# EAGLE design blmc_m8_dev (EAGLE 4.11)
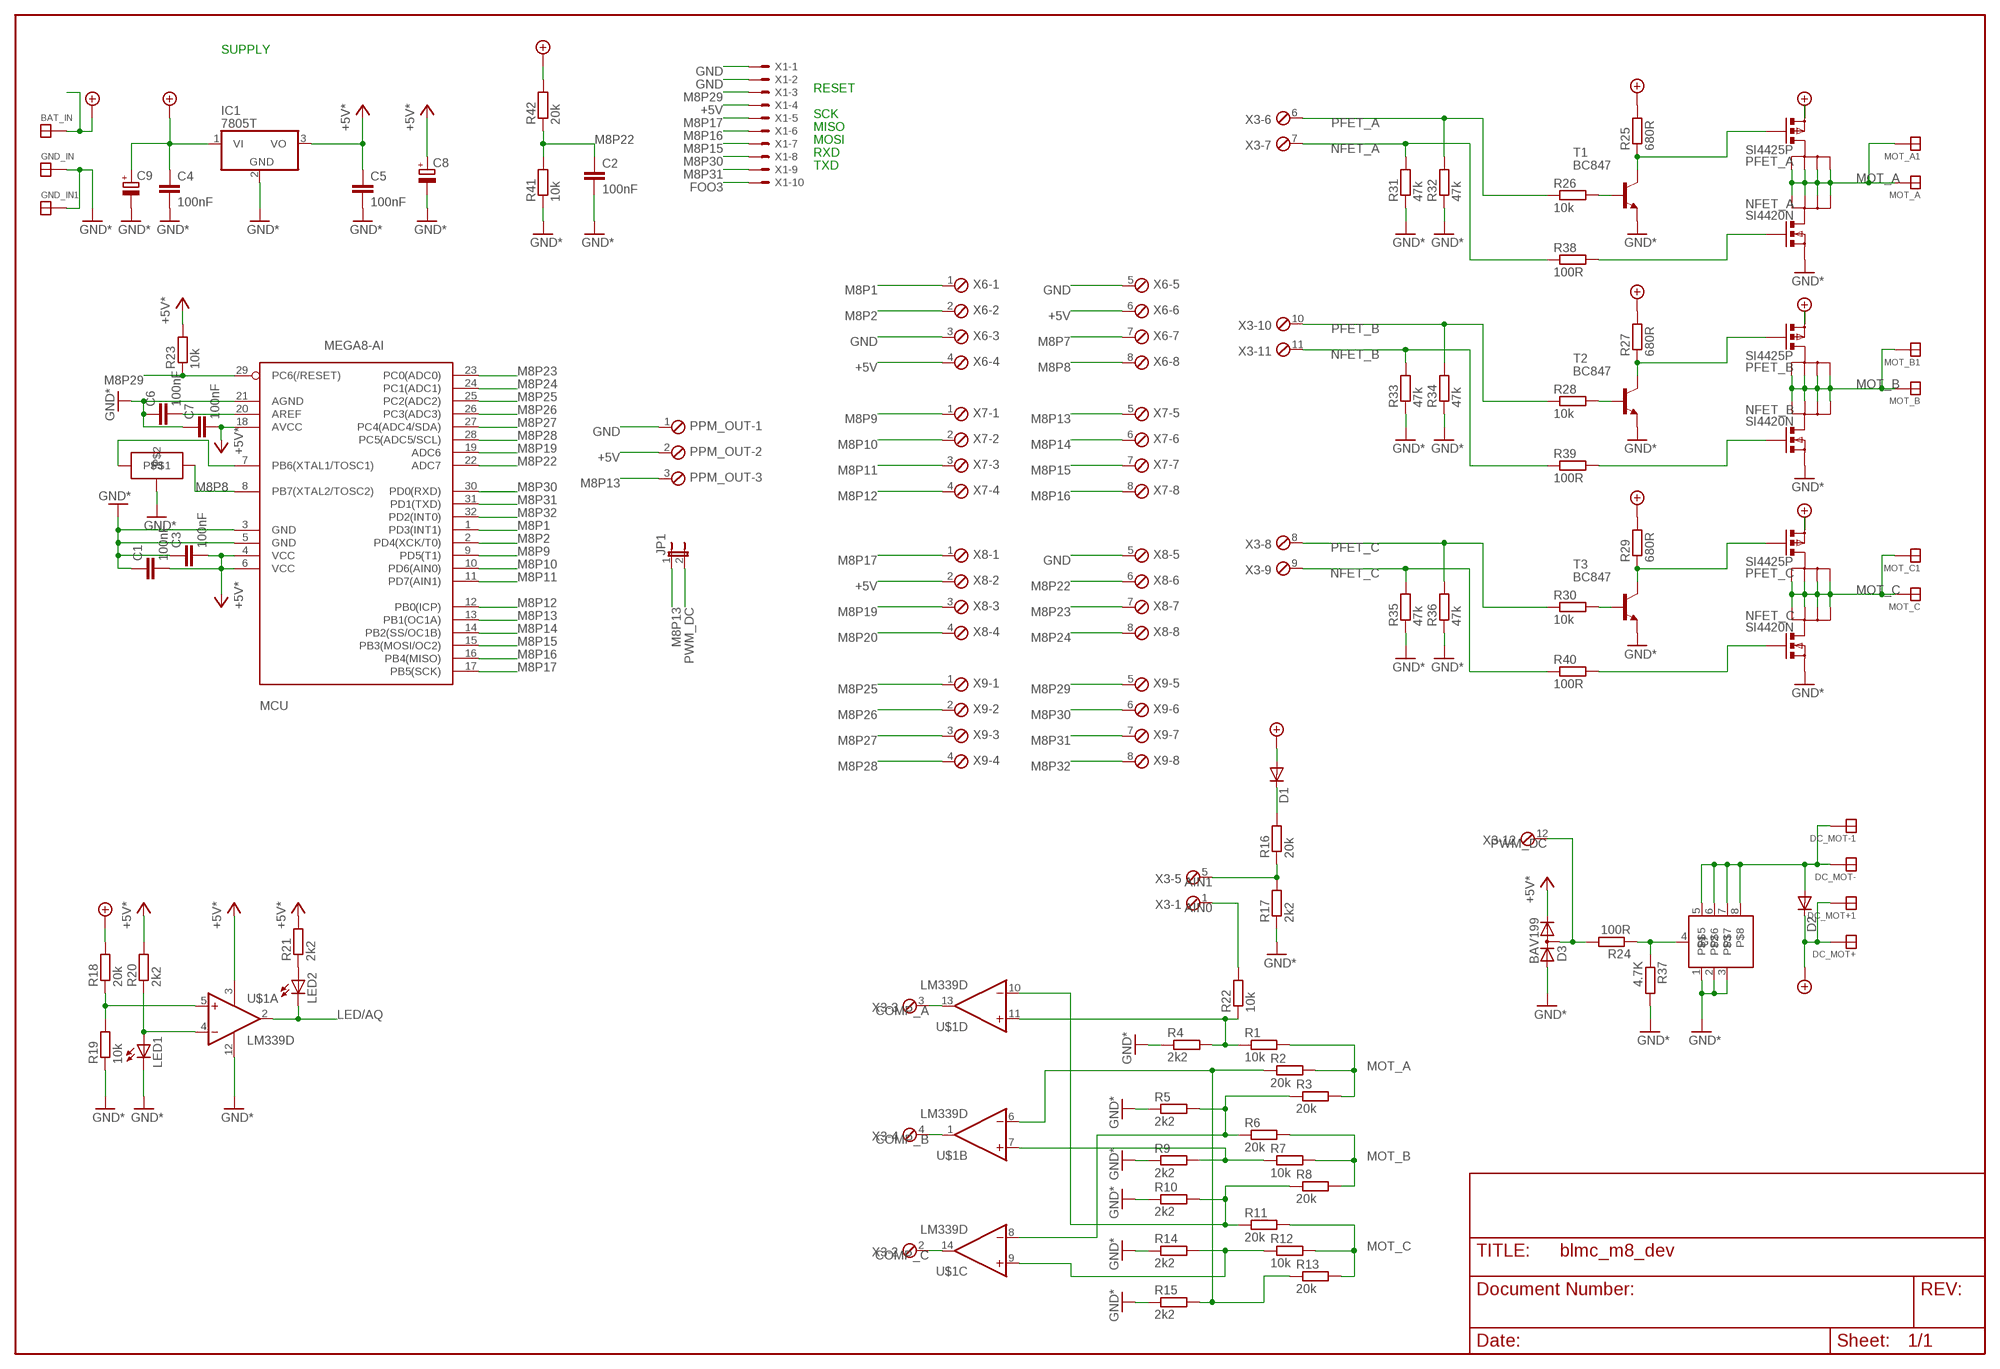
[diagram p0: schematic, sheet 1]

## Parts
BAT_IN  SOLDER_PAD200_50  [SOLDER_PAD_200_50]
C1  100nF  C-EUC0603  [C0603]
C2  100nF  C-EUC0603  [C0603]
C3  100nF  C-EUC0603  [C0603]
C4  100nF  C-EUC0603  [C0603]
C5  100nF  C-EUC0603  [C0603]
C6  100nF  C-EUC0603  [C0603]
C7  100nF  C-EUC0603  [C0603]
C8  CPOL-EUE5-10.5  [E5-10,5]
C9  CPOL-EUE5-10.5  [E5-10,5]
D1  DIODE-SOD80C  [SOD80C]
D2  DIODE-DO214BA  [DO214BA]
D3  BAV199  [SOT23]
DC_MOT+  SOLDER_PAD200_50  [SOLDER_PAD_200_50]
DC_MOT+1  SOLDER_PAD200_50  [SOLDER_PAD_200_50]
DC_MOT-  SOLDER_PAD200_50  [SOLDER_PAD_200_50]
DC_MOT-1  SOLDER_PAD200_50  [SOLDER_PAD_200_50]
GND_IN  SOLDER_PAD200_50  [SOLDER_PAD_200_50]
GND_IN1  SOLDER_PAD200_50  [SOLDER_PAD_200_50]
IC1  7805T  [TO220H]
JP1  JP1E  [JP1]
LED1  LEDCHIP-LED0805  [CHIP-LED0805]
LED2  LEDCHIP-LED0805  [CHIP-LED0805]
MCU  MEGA8-AI  [TQFP32-08]
MOT_A  SOLDER_PAD200_50  [SOLDER_PAD_200_50]
MOT_A1  SOLDER_PAD200_50  [SOLDER_PAD_200_50]
MOT_B  SOLDER_PAD200_50  [SOLDER_PAD_200_50]
MOT_B1  SOLDER_PAD200_50  [SOLDER_PAD_200_50]
MOT_C  SOLDER_PAD200_50  [SOLDER_PAD_200_50]
MOT_C1  SOLDER_PAD200_50  [SOLDER_PAD_200_50]
NFET_A  SI4420N  [SO-8]
NFET_B  SI4420N  [SO-8]
NFET_C  SI4420N  [SO-8]
PFET_A  SI4425P  [SO-8]
PFET_B  SI4425P  [SO-8]
PFET_C  SI4425P  [SO-8]
PPM_OUT  MPT3  [3POL254]
R1  10k  R-EU_R0603  [R0603]
R2  20k  R-EU_R0603  [R0603]
R3  20k  R-EU_R0603  [R0603]
R4  2k2  R-EU_R0603  [R0603]
R5  2k2  R-EU_R0603  [R0603]
R6  20k  R-EU_R0603  [R0603]
R7  10k  R-EU_R0603  [R0603]
R8  20k  R-EU_R0603  [R0603]
R9  2k2  R-EU_R0603  [R0603]
R10  2k2  R-EU_R0603  [R0603]
R11  20k  R-EU_R0603  [R0603]
R12  10k  R-EU_R0603  [R0603]
R13  20k  R-EU_R0603  [R0603]
R14  2k2  R-EU_R0603  [R0603]
R15  2k2  R-EU_R0603  [R0603]
R16  20k  R-EU_R0603  [R0603]
R17  2k2  R-EU_R0603  [R0603]
R18  20k  R-EU_R0603  [R0603]
R19  10k  R-EU_R0603  [R0603]
R20  2k2  R-EU_R0603  [R0603]
R21  2k2  R-EU_R0603  [R0603]
R22  10k  R-EU_R0603  [R0603]
R23  10k  R-EU_R0603  [R0603]
R24  100R  R-EU_R0603  [R0603]
R25  680R  R-EU_R0603  [R0603]
R26  10k  R-EU_R0603  [R0603]
R27  680R  R-EU_R0603  [R0603]
R28  10k  R-EU_R0603  [R0603]
R29  680R  R-EU_R0603  [R0603]
R30  10k  R-EU_R0603  [R0603]
R31  47k  R-EU_R0603  [R0603]
R32  47k  R-EU_R0603  [R0603]
R33  47k  R-EU_R0603  [R0603]
R34  47k  R-EU_R0603  [R0603]
R35  47k  R-EU_R0603  [R0603]
R36  47k  R-EU_R0603  [R0603]
R37  4.7K  R-EU_R0603  [R0603]
R38  100R  R-EU_R0603  [R0603]
R39  100R  R-EU_R0603  [R0603]
R40  100R  R-EU_R0603  [R0603]
R41  10k  R-EU_R0603  [R0603]
R42  20k  R-EU_R0603  [R0603]
T1  BC847  [SOT23]
T2  BC847  [SOT23]
T3  BC847  [SOT23]
U$1  LM339D  [DIL-14]
U$2  IRF7809  [SO08]
U$9  MICRO_RESO  [MICRO_CRYSTAL]
X1  53047-10  [53047-10]
X3  MPT12  [12POL254]
X6  MPT8  [8POL254]
X7  MPT8  [8POL254]
X8  MPT8  [8POL254]
X9  MPT8  [8POL254]

## Nets
+5V: C1.1 C3.1 C5.2 C7.1 C8.+ D3.2(C) IC1.3(VO) MCU.4(VCC) MCU.6(VCC) MCU.18(AVCC) PPM_OUT.2 R20.2 R21.2 R23.2 U$1.3(A:V+) X1.4 X6.4 X6.6 X8.2 ; supply symbol labelled +5V*
+UB: BAT_IN.P$1 C4.2 C9.+ D1.A D2.C DC_MOT+1.P$1 DC_MOT+.P$1 IC1.1(VI) PFET_A.1(S) PFET_B.1(S) PFET_C.1(S) R18.2 R25.2 R27.2 R29.2 R42.2
AIN0: R22.2 X3.1
AIN1: R16.1 R17.2 X3.5
COMP_A: U$1.13(D:OUT) X3.3
COMP_B: U$1.1(B:OUT) X3.4
COMP_C: U$1.14(C:OUT) X3.2
FOO3: X1.10
GND: C1.2 C2.1 C3.2 C4.1 C5.1 C6.2 C7.2 C8.- C9.- D3.1(A) GND_IN1.P$1 GND_IN.P$1 IC1.2(GND) LED1.C MCU.3(GND) MCU.5(GND) MCU.21(AGND) NFET_A.1(S) NFET_B.1(S) NFET_C.1(S) PPM_OUT.1 R4.1 R5.1 R9.1 R10.1 R14.1 R15.1 R17.1 R19.1 R31.1 R32.1 R33.1 R34.1 R35.1 R36.1 R37.2 R41.1 T1.2(E) T2.2(E) T3.2(E) U$1.12(A:GND) U$2.1 U$2.2 U$2.3 U$9.P$2 X1.1 X1.2 X6.3 X6.5 X8.5 ; supply symbol labelled GND*
LED/AQ: LED2.C U$1.2(A:OUT)
M8P1: MCU.1(PD3(INT1)) X6.1
M8P2: MCU.2(PD4(XCK/T0)) X6.2
M8P7: MCU.7(PB6(XTAL1/TOSC1)) U$9.P$3 X6.7
M8P8: MCU.8(PB7(XTAL2/TOSC2)) U$9.P$1 X6.8
M8P9: MCU.9(PD5(T1)) X7.1
M8P10: MCU.10(PD6(AIN0)) X7.2
M8P11: MCU.11(PD7(AIN1)) X7.3
M8P12: MCU.12(PB0(ICP)) X7.4
M8P13: JP1.1 MCU.13(PB1(OC1A)) PPM_OUT.3 X7.5
M8P14: MCU.14(PB2(SS/OC1B)) X7.6
M8P15: MCU.15(PB3(MOSI/OC2)) X1.7 X7.7
M8P16: MCU.16(PB4(MISO)) X1.6 X7.8
M8P17: MCU.17(PB5(SCK)) X1.5 X8.1
M8P19: MCU.19(ADC6) X8.3
M8P20: C6.1 MCU.20(AREF) X8.4
M8P22: C2.2 MCU.22(ADC7) R41.2 R42.1 X8.6
M8P23: MCU.23(PC0(ADC0)) X8.7
M8P24: MCU.24(PC1(ADC1)) X8.8
M8P25: MCU.25(PC2(ADC2)) X9.1
M8P26: MCU.26(PC3(ADC3)) X9.2
M8P27: MCU.27(PC4(ADC4/SDA)) X9.3
M8P28: MCU.28(PC5(ADC5/SCL)) X9.4
M8P29: MCU.29(PC6(/RESET)) R23.1 X1.3 X9.5
M8P30: MCU.30(PD0(RXD)) X1.8 X9.6
M8P31: MCU.31(PD1(TXD)) X1.9 X9.7
M8P32: MCU.32(PD2(INT0)) X9.8
MOT_A: MOT_A1.P$1 MOT_A.P$1 NFET_A.5(D1) NFET_A.6(D2) NFET_A.7(D3) NFET_A.8(D4) PFET_A.5(D1) PFET_A.6(D2) PFET_A.7(D3) PFET_A.8(D4) R1.2 R2.2 R3.2
MOT_B: MOT_B1.P$1 MOT_B.P$1 NFET_B.5(D1) NFET_B.6(D2) NFET_B.7(D3) NFET_B.8(D4) PFET_B.5(D1) PFET_B.6(D2) PFET_B.7(D3) PFET_B.8(D4) R6.2 R7.2 R8.2
MOT_C: MOT_C1.P$1 MOT_C.P$1 NFET_C.5(D1) NFET_C.6(D2) NFET_C.7(D3) NFET_C.8(D4) PFET_C.5(D1) PFET_C.6(D2) PFET_C.7(D3) PFET_C.8(D4) R11.2 R12.2 R13.2
N$1: D2.A DC_MOT-1.P$1 DC_MOT-.P$1 U$2.5 U$2.6 U$2.7 U$2.8
N$2: R2.1 R13.1 R15.2 U$1.6(B:-IN)
N$3: R1.1 R4.2 R22.1 U$1.11(D:+IN)
N$5: NFET_A.4(G) R38.2
N$7: R24.1 R37.1 U$2.4(G)
N$8: NFET_B.4(G) R39.2
N$9: NFET_C.4(G) R40.2
N$10: R3.1 R5.2 R6.1 U$1.8(C:-IN)
N$12: R7.1 R9.2 U$1.7(B:+IN)
N$13: R8.1 R10.2 R11.1 U$1.10(D:-IN)
N$15: R12.1 R14.2 U$1.9(C:+IN)
N$21: LED2.A R21.1
N$23: R18.1 R19.2 U$1.5(A:+IN)
N$24: PFET_B.4(G) R27.1 T2.3(C)
N$25: LED1.A R20.1 U$1.4(A:-IN)
N$29: D1.C R16.2
N$34: PFET_A.4(G) R25.1 T1.3(C)
N$39: PFET_C.4(G) R29.1 T3.3(C)
N$46: R30.2 T3.1(B)
N$47: R28.2 T2.1(B)
N$48: R26.2 T1.1(B)
NFET_A: R31.2 R38.1 X3.7
NFET_B: R33.2 R39.1 X3.11
NFET_C: R35.2 R40.1 X3.9
PFET_A: R26.1 R32.2 X3.6
PFET_B: R28.1 R34.2 X3.10
PFET_C: R30.1 R36.2 X3.8
PWM_DC: D3.3(AC) JP1.2 R24.2 X3.12

## Notes on the sheet
- SUPPLY
- RESET
- SCK
- MISO
- MOSI
- RXD
- TXD

## Library data of the parts
BAT_IN DC_MOT+ DC_MOT+1 DC_MOT- DC_MOT-1 GND_IN GND_IN1 MOT_A MOT_A1 MOT_B MOT_B1 MOT_C MOT_C1 = paparazzi:SOLDER_PAD
C1-C7 = rcl:C-EU: CAPACITOR, European symbol
C8 C9 = rcl:CPOL-EU: POLARIZED CAPACITOR, European symbol
D1 D2 = diode:DIODE-: DIODE
D3 = diode:BAV199: DIODE low-leakage double diode
IC1 = linear:78*: Positive VOLTAGE REGULATOR Source: http://cache.national.com/ds/LM/LM78L05.pdf http://www.fairchildsemi.com/ds/LM/LM7805.pdf
JP1 = jumper:JP1E: JUMPER
LED1 LED2 = led:LED: LED OSRAM: - CHIPLED LG R971, LG N971, LY N971, LG Q971, LY Q971, LO R971, LY R971 LH N974, LH R974 LS Q976, LO Q976, LY Q976 LO Q996 - Hyper CHIPLED LW Q18S LB Q993, LB Q99A, LB R99A - SideLED LS A670, LO A670, LY A670, LG A670, LP A670 LB A673, LV A673, LT A673, LW A673 LH A674 LY A675 LS A676, LA A676, LO A676, LY A676, LW A676 LS A679, LY A679, LG A679 - Hyper Micro SIDELED® LS Y876, LA Y876, LO Y876, LY Y876 LT Y87S - SmartLED LW L88C, LW L88S LB L89C, LB L89S, LG L890 LS L89K, LO L89K, LY L89K LS L896, LA L896, LO L896, LY L896 - TOPLED LS T670, LO T670, LY T670, LG T670, LP T670 LSG T670, LSP T670, LSY T670, LOP T670, LYG T670 LG T671, LOG T671, LSG T671 LB T673, LV T673, LT T673, LW T673 LH T674 LS T676, LA T676, LO T676, LY T676, LB T676, LH T676, LSB T676, LW T676 LB T67C, LV T67C, LT T67C, LS T67K, LO T67K, LY T67K, LW E67C LS E67B, LA E67B, LO E67B, LY E67B, LB E67C, LV E67C, LT E67C LW T67C LS T679, LY T679, LG T679 LS T770, LO T770, LY T770, LG T770, LP T770 LB T773, LV T773, LT T773, LW T773 LH T774 LS E675, LA E675, LY E675, LS T675 LS T776, LA T776, LO T776, LY T776, LB T776 LHGB T686 LT T68C, LB T68C - Hyper Mini TOPLED® LB M676 - Mini TOPLED Santana® LG M470 LS M47K, LO M47K, LY M47K Source: http://www.osram.convergy.de/
MCU = atmel:MEGA8: MICROCONTROLLER 8 Kbytes FLASH 1 kbytes SRAM 512 bytes EEPROM USART 6-channel 10 bit ADC 2-channel 8 bit ADC
NFET_A NFET_B NFET_C = bko:SI4420
PFET_A PFET_B PFET_C = bko:SI4425
PPM_OUT = con-phoenix-254:MPT3: PHOENIX CONNECTOR
R1-R42 = rcl:R-EU_: RESISTOR, European symbol
T1-T3 = transistor-npn:BC847: NPN TRANSISTOR
U$1 = bko:LM339
U$2 = paparazzi:IRF7809
U$9 = paparazzi:MICRO_RESO
X1 = con-molex:53?-10: CONNECTOR wire to board 1.25 mm (.049 inch) pitch header
X3 = con-phoenix-254:MPT12: PHOENIX CONNECTOR
X6-X9 = con-phoenix-254:MPT8: PHOENIX CONNECTOR

## Board
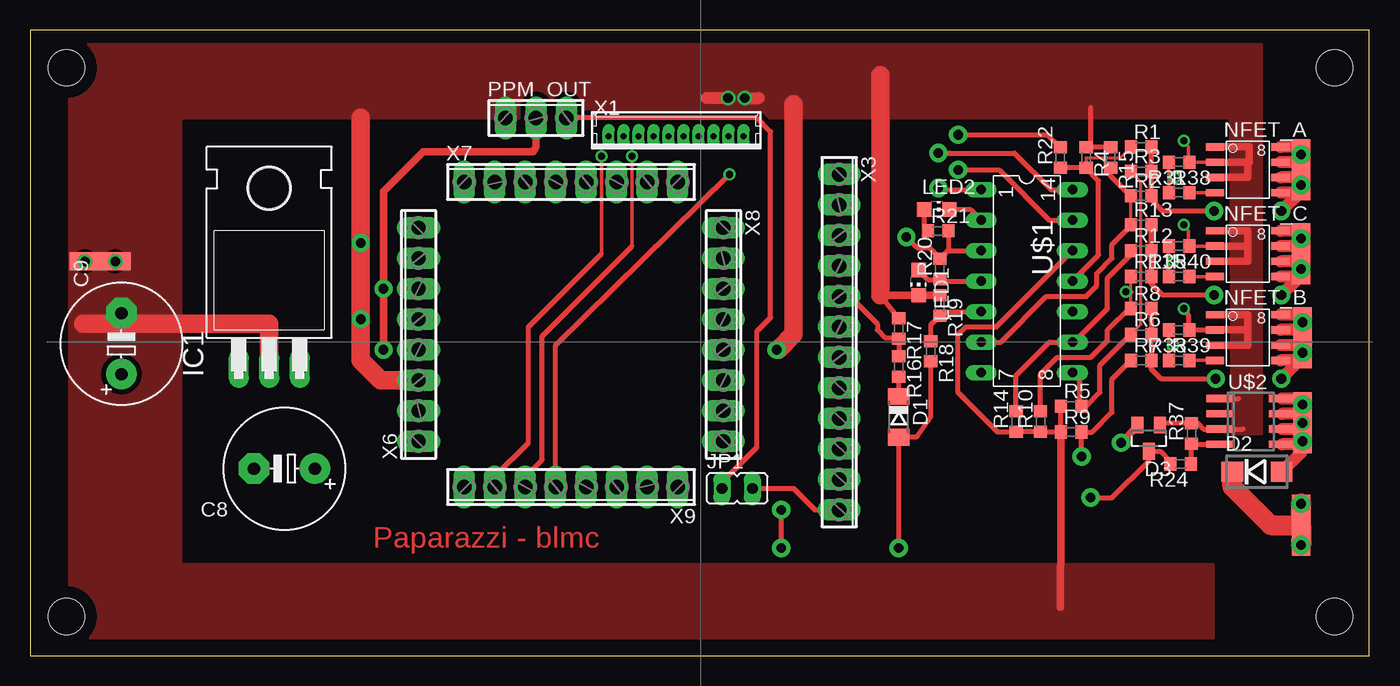
[diagram p1: board, top side]
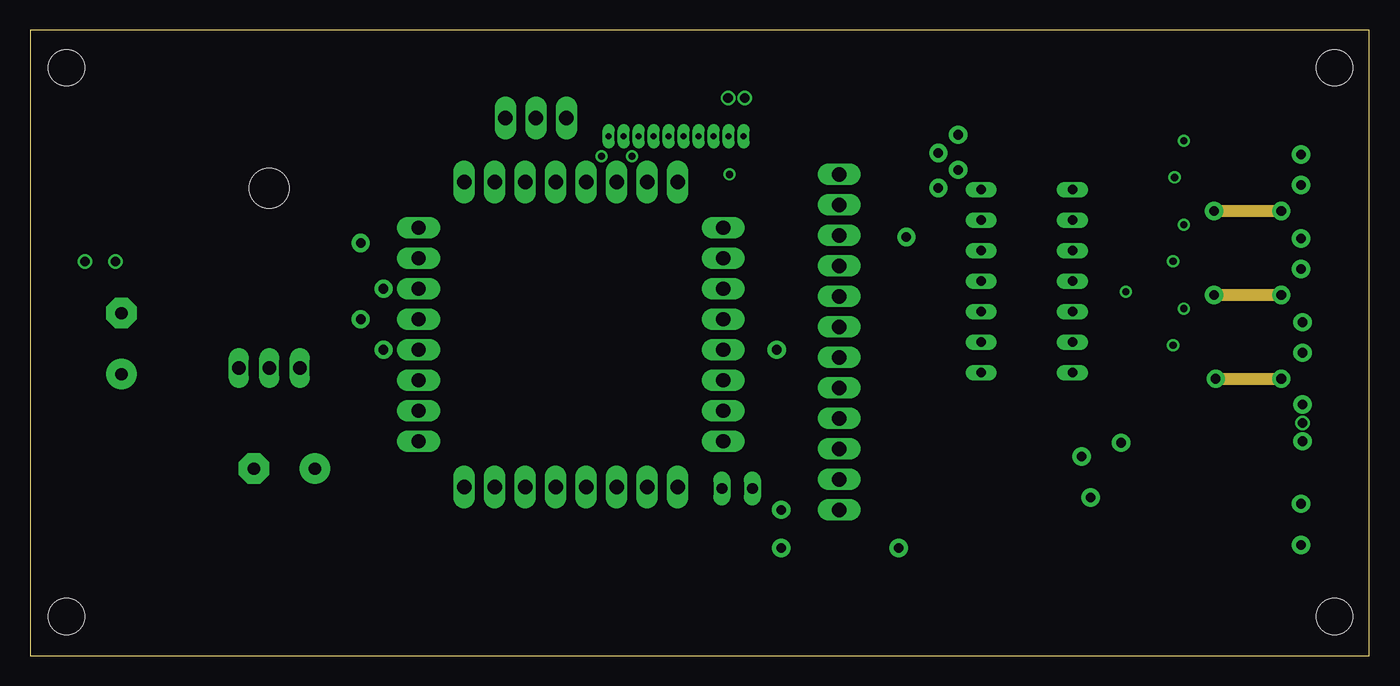
[diagram p2: board, inner layer Route2]
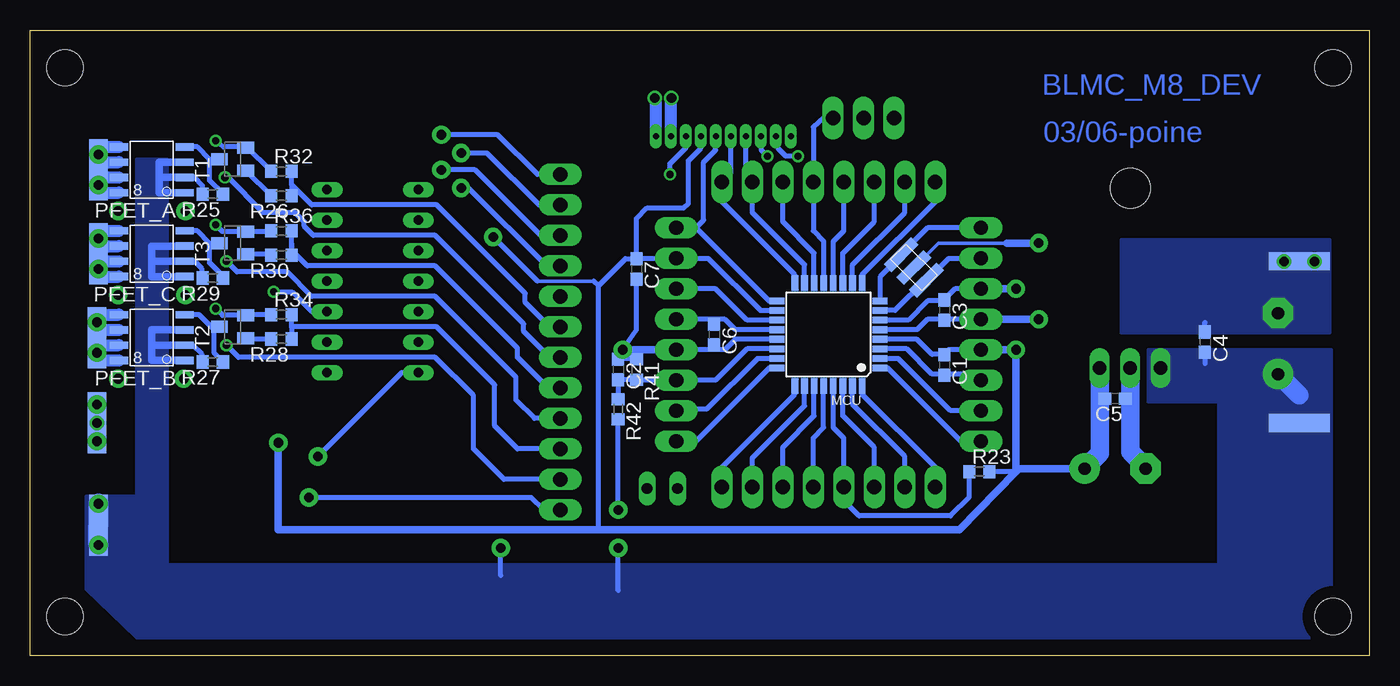
[diagram p3: board, bottom side, seen from below]

Size 111.61 x 52.12 mm. Coordinates in mm from the lower left corner, seen from the top.
Outline: 0,0 111.61,0 111.61,52.12 0,52.12 0,0
Copper layers (1*16): Top 0.035mm / dielectric 1.5mm / Bottom 0.035mm
Design rules "default": minimum track width 10mil, minimum drill 24mil, track to track 8mil, track to pad 8mil, pad to pad 8mil, via to via 8mil, smd to smd 8mil, copper to edge 40mil, drill to drill 8mil, minimum pad ring 10mil, minimum via ring 8mil, stop-mask expansion 4mil, vias tented up to drill 0mil, thermal gap 10mil
Holes 3 mm at 3.04,48.98 108.71,48.98 108.71,3.26 3.04,3.26

### Footprints (pad centres in the part's own frame; a part is rotated, then mirrored left to right if it is on the bottom)
SOLDER_PAD_200_50 = smd 5.08 x 1.524: P$1 0,0
C0603 = smd 1.1 x 1: 1 -0.85,0; 2 0.85,0
E5-10,5 = drill 1.016 pad 2.54 round: + -2.54,0 | drill 1.016 pad 2.54 octagon: - 2.54,0
SOD80C = smd 1.4 x 1.8: A 1.7,0; C -1.7,0
DO214BA = smd 1.8 x 1.7: A 2.05,0; C -2.05,0
SOT23 = smd 1 x 1.4: 1 -0.95,-1.1; 2 0.95,-1.1; 3 0,1.1
TO220H = drill 1.118 long: 1 -2.54,-10.16; 2 0,-10.16; 3 2.54,-10.16 | hole 3.302: 0,4.826
JP1 = drill 0.914 long: 1 0,-1.27; 2 0,1.27
CHIP-LED0805 = smd 1.2 x 1.2: A 0,-1.05; C 0,1.05
TQFP32-08 = smd 1.27 x 0.559: 1 -4.293,2.8; 2 -4.293,2; 3 -4.293,1.2; 4 -4.293,0.4; 5 -4.293,-0.4; 6 -4.293,-1.2; 7 -4.293,-2; 8 -4.293,-2.8; 17 4.293,-2.8; 18 4.293,-2; 19 4.293,-1.2; 20 4.293,-0.4; 21 4.293,0.4; 22 4.293,1.2; 23 4.293,2; 24 4.293,2.8 | smd 0.559 x 1.27: 9 -2.8,-4.293; 10 -2,-4.293; 11 -1.2,-4.293; 12 -0.4,-4.293; 13 0.4,-4.293; 14 1.2,-4.293; 15 2,-4.293; 16 2.8,-4.293; 25 2.8,4.293; 26 2,4.293; 27 1.2,4.293; 28 0.4,4.293; 29 -0.4,4.293; 30 -1.2,4.293; 31 -2,4.293; 32 -2.8,4.293
SO-8 = smd 1.524 x 0.61: 1 -2.743,1.27; 2 -2.743,0; 3 -2.743,-1.27; 4 -2.743,-2.54; 5 2.743,-2.54; 6 2.743,-1.27; 7 2.743,0; 8 2.743,1.27
3POL254 = drill 1.2 long: 1 -2.54,0; 2 0,0; 3 2.54,0
R0603 = smd 1 x 1.1: 1 -0.85,0; 2 0.85,0
DIL-14 = drill 0.8 long: 1 -3.81,-3.81; 2 -1.27,-3.81; 3 1.27,-3.81; 4 3.81,-3.81; 5 6.35,-3.81; 6 8.89,-3.81; 7 11.43,-3.81; 8 11.43,3.81; 9 8.89,3.81; 10 6.35,3.81; 11 3.81,3.81; 12 1.27,3.81; 13 -1.27,3.81; 14 -3.81,3.81
SO08 = smd 0.6 x 2.2: 1 -1.905,-2.6; 2 -0.635,-2.6; 3 0.635,-2.6; 4 1.905,-2.6; 5 1.905,2.6; 6 0.635,2.6; 7 -0.635,2.6; 8 -1.905,2.6
MICRO_CRYSTAL = smd 0.9 x 3.2: P$1 -1.5,0; P$2 0,0; P$3 1.5,0
53047-10 = drill 0.5 pad 0.698 long: 1 5.625,0; 2 4.375,0; 3 3.125,0; 4 1.875,0; 5 0.625,0; 6 -0.625,0; 7 -1.875,0; 8 -3.125,0; 9 -4.375,0; 10 -5.625,0
12POL254 = drill 1.2 long: 1 -13.97,0; 2 -11.43,0; 3 -8.89,0; 4 -6.35,0; 5 -3.81,0; 6 -1.27,0; 7 1.27,0; 8 3.81,0; 9 6.35,0; 10 8.89,0; 11 11.43,0; 12 13.97,0
8POL254 = drill 1.2 long: 1 -8.89,0; 2 -6.35,0; 3 -3.81,0; 4 -1.27,0; 5 1.27,0; 6 3.81,0; 7 6.35,0; 8 8.89,0

### Placement (x,y rotation side)
BAT_IN  5.84,19.39 180 bottom
C1  35.43,24.22 270 bottom
C2  62.61,23.84 270 bottom
C3  35.43,28.79 270 bottom
C4  13.71,26.12 270 bottom
C5  21.2,21.43 180 bottom
C6  54.6,26.76 270 bottom
C7  61.08,32.22 270 bottom
C8  21.2,15.58 180 top
C9  7.62,26 90 top
D1  72.39,19.9 270 top
D2  102.23,15.33 0 top
D3  93.21,18.12 180 top
DC_MOT+  105.91,10.88 90 top
DC_MOT+1  105.91,10.88 270 bottom
DC_MOT-  106.04,19.39 270 top
DC_MOT-1  106.04,19.39 90 bottom
GND_IN  5.84,32.86 180 top
GND_IN1  5.84,32.86 0 bottom
IC1  19.93,34.12 0 top
JP1  58.92,13.93 270 top
LED1  74.04,31.08 180 top
LED2  75.56,37.17 270 top
MCU  45.08,26.76 180 bottom
MOT_A  105.91,40.47 90 top
MOT_A1  105.91,40.47 270 bottom
MOT_B  106.04,26.5 90 top
MOT_B1  106.04,26.5 90 bottom
MOT_C  105.91,33.49 90 top
MOT_C1  105.91,33.49 270 bottom
NFET_A  101.47,41.11 0 top
NFET_B  101.47,27.14 0 top
NFET_C  101.47,34.12 0 top
PFET_A  101.47,39.84 180 bottom
PFET_B  101.47,25.87 180 bottom
PFET_C  101.47,32.86 180 bottom
PPM_OUT  42.16,44.79 0 top
R1  92.58,42.38 0 top
R2  92.58,38.32 0 top
R3  92.58,40.35 0 top
R4  88.01,41.49 270 top
R5  86.74,20.79 0 top
R6  92.58,26.76 0 top
R7  92.58,24.6 0 top
R8  92.58,28.92 0 top
R9  86.74,18.63 0 top
R10  84.2,19.52 90 top
R11  92.58,31.59 0 top
R12  92.58,33.74 0 top
R13  92.58,35.9 0 top
R14  82.16,19.52 90 top
R15  90.04,41.49 270 top
R16  72.39,24.09 270 top
R17  72.39,27.27 270 top
R18  75.05,25.36 270 top
R19  75.81,29.17 270 top
R20  75.81,32.22 90 top
R21  75.69,35.39 0 top
R22  85.85,41.49 90 top
R23  32.51,15.33 0 bottom
R24  95.88,15.96 180 top
R25  96.39,38.44 180 bottom
R26  90.67,38.32 180 bottom
R27  96.39,24.47 180 bottom
R28  90.67,26.38 180 bottom
R29  96.39,31.46 180 bottom
R30  90.67,33.36 180 bottom
R31  95.75,41.11 180 top
R32  90.67,40.35 0 bottom
R33  95.75,27.14 180 top
R34  90.67,28.41 0 bottom
R35  95.75,34.12 180 top
R36  90.67,35.39 0 bottom
R37  96.77,18.5 90 top
R38  95.75,38.57 0 top
R39  95.75,24.6 0 top
R40  95.75,31.59 0 top
R41  61.08,23.84 270 bottom
R42  62.61,20.54 270 bottom
T1  94.74,41.36 90 bottom
T2  94.74,27.39 90 bottom
T3  94.74,34.38 90 bottom
U$1  83.05,35.01 270 top
U$2  101.72,19.52 270 top
U$9  37.97,32.35 315 bottom
X1  53.84,43.27 0 top
X3  67.43,26.12 270 top
X6  32.38,26.76 90 top
X7  45.08,39.46 0 top
X8  57.78,26.76 270 top
X9  45.08,14.06 180 top

### Tracks (layer width: path | path; a pad name or v marks a point on that pad's centre or on a via)
+5V  (via drill 0.8 pad 1.52)
  Top 0.406: R21.2 76.58,35.39 76.58,33.83 76.47,33.72 | 76.47,33.72 R20.2 75.81,33.11 74.93,34 73.91,34 v73.02,34.89 | 76.47,33.72 76.45,33.74 U$1.3
  Top 0.61: v29.46,25.49 29.46,30.44 | 29.46,30.44 v29.46,30.57 | D3.2 92.26,19.2 92.32,19.14 v90.93,17.74 | PPM_OUT.2 42.16,42.38 41.91,42 32.76,42 29.46,38.7 29.46,30.44
  Bottom 0.305: 64.64,31.2 69.34,31.2
  Bottom 0.406: 35.47,25.07 35.55,24.98 | 35.47,25.07 C1.1 35.43,25.11 | X6.4 35.05,25.49 35.43,25.11 | 35.43,25.11 35.47,25.07 | MCU.4 37.7,26.36 36.44,25.11 35.43,25.11 | X6.6 34.54,30.57 35.47,29.64 | MCU.6 38.42,27.96 36.82,29.55 35.55,29.55 35.47,29.64 | 35.47,29.64 C3.1 | MCU.18 50.76,28.76 55.11,33.11 X8.2 61.08,33.11 | 22.47,21.43 C5.2 | 29.46,15.33 R23.2 | 64.26,30.82 62.01,33.07 C7.1 61.08,33.11 | 64.26,10.5 64.26,30.82 | 64.26,30.82 64.64,31.2 | 69.34,31.2 v73.02,34.89 | X1.4 55.72,42.28 56.76,41.24 56.76,37.68 57.14,37.3 60.19,37.3 61.08,36.41 61.08,33.11
  Bottom 0.61: X6.4 v29.46,25.49 29.46,15.46 29.39,15.39 | v29.46,30.57 X6.6 | 29.39,15.39 29.2,15.58 C8.+ | 29.39,15.39 29.46,15.33 34.16,10.5 64.26,10.5 90.93,10.5 v90.93,17.74
  Bottom 1.524: IC1.3 22.47,21.43 22.47,16.85 C8.+
+UB  (via drill 0.8 pad 1.52)
  Top 0.406: v62.61,8.98 v62.61,12.15 | R18.2 75.05,19.9 73.91,18.25 72.39,18.25 | 72.39,18.25 72.26,18.25 72.31,18.2 D1.A 72.39,18.25 | v72.39,8.98 72.39,18.25
  Top 1.524: IC1.1 17.39,24.73
  Top 1.676: D2.C 100.2,15.33 100.2,14.06 103.37,10.88 DC_MOT+1.P$1 | DC_MOT+1.P$1 105.91,12.28 | DC_MOT+1.P$1 105.91,9.61 | DC_MOT+1.P$1 v105.91,9.23 | DC_MOT+1.P$1 v105.91,12.66
  Bottom 0.406: 98.29,25.87 98.04,25.87 97.28,25.11 97.28,24.47 R27.2 | R25.2 97.24,39.17 97.91,39.84 98.93,39.84 | 98.29,32.86 97.91,32.86 97.28,32.22 97.28,31.46 R29.2 | C4.2 13.71,24.35 | v62.61,12.15 R42.2 | 62.61,5.42 v62.61,8.98 | 72.39,6.69 v72.39,8.98
  Bottom 0.61: PFET_A.1 100.83,38.57 100.83,39.84 | 98.93,39.84 100.83,39.84 | 100.83,39.84 100.83,41.11 98.93,41.11 | PFET_C.1 101.47,31.59 101.47,32.86 | 98.29,32.86 101.47,32.86 | 101.47,32.86 101.47,34.12 98.29,34.12 | PFET_B.1 101.47,24.6 101.47,25.87 | 98.29,25.87 101.47,25.87 | 101.47,25.87 101.47,27.14 98.29,27.14
  Bottom 1.524: 5.84,21.68 C9.+
  Bottom 1.676: v105.91,12.66 DC_MOT+1.P$1 v105.91,9.23
  pour Bottom (isolate 0.406, no thermals): 100.2,41.36 102.74,41.36 102.74,13.3 106.93,13.3 106.93,5.55 102.74,1.49 3.17,1.49 3.17,25.49 18.41,25.49 18.41,21.17 12.57,21.17 12.57,7.58 100.2,7.58
AIN0  (via drill 0.8 pad 1.52)
  Top 0.406: R22.2 84.79,43.4 v77.34,43.4
  Bottom 0.406: v77.34,43.4 72.64,43.4 69.34,40.09 X3.1
AIN1
  Top 0.406: R16.1 R17.2 72.39,26.5 71.24,26.5 70.61,27.14 70.61,27.65 68.32,29.93 X3.5
COMP_A  (via drill 0.8 pad 1.52)
  Top 0.406: v77.34,40.47 80.77,40.47 84.96,36.28 86.74,36.28 86.86,36.41 U$1.13
  Bottom 0.406: v77.34,40.47 74.54,40.47 69.08,35.01 X3.3 67.31,35.01
COMP_B  (via drill 0.8 pad 1.52)
  Top 0.406: v75.69,38.95 75.81,38.82 U$1.1
  Bottom 0.406: X3.4 68.58,32.47 75.05,38.95 v75.69,38.95
COMP_C  (via drill 0.8 pad 1.52)
  Top 0.406: U$1.14 85.09,38.82 82.04,41.87 v75.69,41.87 76.58,41.87
  Bottom 0.406: v75.69,41.87 73.53,41.87 69.21,37.55 X3.2
GND  (via drill 0.6, 0.8, 0.8 pad 1.52)
  Top 0.305: 98.29,34.12 R35.1 96.52,34.12 96.52,35.39 v96.13,35.9 | 96.52,27.14 R33.1 | 98.29,41.11 R31.1 96.52,41.11 96.52,42.38 v96.13,42.89
  Top 0.406: R33.1 98.29,27.14 | 96.52,27.14 96.52,28.41 v96.13,28.92 | R5.1 85.89,18.67 85.85,18.63 R9.1 84.2,18.63 R10.1 R14.1 | R14.1 82.04,18.63 82.08,18.67 R14.1 | U$2.1 100.71,21.43 | 101.09,18.89 U$2.3 97.79,18.89 97.28,19.39 96.77,19.39 | 96.77,19.39 R37.2 | D3.1 94.33,19.39 96.77,19.39 | R17.1 70.86,30.02 | R15.1 90.04,42.38 88.39,42.38 | 88.39,42.38 88.05,42.38 R4.1 | 88.39,42.38 88.39,45.68 | U$1.12 80.51,27.39 77.97,27.39 77.34,26.76 77.34,21.93 80.64,18.63 82.16,18.63 R14.1
  Top 0.61: NFET_A.1 101.59,42.38 101.59,41.11 101.47,41.11 | 98.29,41.11 101.47,41.11 | 101.47,41.11 101.47,39.84 98.29,39.84 | NFET_C.1 101.47,35.39 101.47,34.12 | 98.29,34.12 101.47,34.12 | 101.47,34.12 101.47,32.86 98.29,32.86 | NFET_B.1 101.47,28.41 101.47,27.14 | 98.29,27.14 101.47,27.14 | 101.47,27.14 101.47,25.87 98.29,25.87 | 70.86,30.02 74.54,30.02 | 74.54,30.02 R19.1 | 74.54,30.02 LED1.C | 85.89,18.67 85.89,11.05 85.85,4.03
  Top 1.016: v58.16,46.44 56.38,46.44 | v59.56,46.44 60.7,46.44
  Top 1.524: 27.55,44.79 v27.55,34.38 v27.55,28.03 27.55,24.6 29.2,22.95 X6.3 | v62.23,25.49 62.35,25.49 63.62,26.76 63.62,45.94 | IC1.2 19.93,27.65 4.44,27.65 | 70.86,30.02 70.86,48.35
  Bottom 0.305: U$9.P$2 35.94,34.38 30.22,34.38
  Bottom 0.406: v96.13,28.92 95.56,28.34 T2.2 93.64,28.37 93.59,28.41 R34.1 | R36.1 91.56,35.39 91.63,35.33 T3.2 95.56,35.33 v96.13,35.9 | R32.1 93.59,42.38 | T1.2 93.64,42.34 93.59,42.38 | 93.59,42.38 93.47,42.38 | 93.59,42.38 95.5,42.38 v96.13,42.89 | MCU.3 38.55,25.56 36.44,23.46 35.43,23.46 | 35.43,23.46 C1.2 | 35.43,23.46 32.89,23.46 X6.3 | X6.5 35.3,28.03 | 35.3,28.03 35.43,27.9 C3.2 35.39,27.94 35.3,28.03 | MCU.5 37.7,27.16 36.82,28.03 35.3,28.03 | MCU.21 52.85,26.36 53.72,25.49 54.6,25.49 | 54.6,25.49 X8.5 | 54.6,25.49 C6.2 | C7.2 61.08,27.14 v62.23,25.49 R41.1 | C4.1 13.71,27.78 | 19.93,21.43 C5.1 | R41.1 61.08,24.6 | C2.1 62.61,24.73 61.12,24.73 R41.1
  Bottom 0.61: v27.55,34.38 30.22,34.38 | v27.55,28.03 X6.5 | X8.5 v62.23,25.49
  Bottom 1.016: X1.2 58.22,46.39 v58.16,46.44 | X1.1 59.47,46.35 v59.56,46.44
  Bottom 1.524: C8.- 18.54,15.58 19.93,16.98 19.93,21.43 IC1.2
  pour Top (isolate 0.406, no thermals): 100.2,18.5 100.07,44.79 12.57,44.79 12.57,7.58 98.55,7.58 98.55,1.49 3.3,1.49 3.3,50.89 102.61,50.89 102.61,18.5
  pour Bottom (no thermals): 3.3,26.89 20.7,26.89 20.7,34.63 3.3,34.63
LED/AQ
  Top 0.406: U$1.2 78.35,37.17 LED2.C
M8P1
  Bottom 0.406: MCU.1 40.12,23.96 34.03,17.87 X6.1
M8P2
  Bottom 0.406: MCU.2 39.27,24.76 34.92,20.41 X6.2
M8P7
  Bottom 0.406: MCU.7 39.52,28.76 36.95,31.33 U$9.P$3 36.91,31.25 | 36.91,31.25 36.95,31.2 | X6.7 35.05,33.11 36.91,31.25
M8P8
  Bottom 0.406: 39.07,33.41 39.11,33.36 | 39.07,33.41 U$9.P$1 38.94,33.41 | X6.8 36.82,35.65 39.07,33.41 | 38.94,33.41 38.86,33.49 | MCU.8 40.79,31.56 38.94,33.41
M8P9
  Bottom 0.406: MCU.9 42.28,31.72 36.19,37.81 X7.1
M8P10
  Bottom 0.406: MCU.10 43.08,32.57 38.73,36.92 X7.2
M8P11
  Bottom 0.406: MCU.11 43.88,33.55 41.27,36.16 X7.3
M8P12
  Bottom 0.406: MCU.12 44.68,34.53 43.81,35.39 X7.4
M8P13
  Top 0.406: PPM_OUT.3 60.57,44.79 61.72,43.65 61.72,28.16 60.57,27.01 60.57,17.36 57.65,14.44 JP1.1
  Bottom 0.406: MCU.13 45.48,34.53 46.35,35.39 X7.5 46.35,44.03 45.46,44.79 PPM_OUT.3
M8P14
  Bottom 0.406: MCU.14 46.28,33.55 48.89,36.16 X7.6
M8P15
  Bottom 0.406: MCU.15 47.08,32.57 51.43,36.92 X7.7 51.94,39.97 51.94,43.27 X1.7
M8P16
  Bottom 0.406: MCU.16 47.88,31.72 53.97,37.81 X7.8 53.21,40.22 53.21,43.27 X1.6
M8P17
  Bottom 0.406: MCU.17 50.04,29.56 56.13,35.65 | 56.13,35.65 X8.1 | 56.13,35.65 55.49,36.28 55.49,41.11 54.48,42.13 X1.5
M8P19
  Bottom 0.406: MCU.19 51.87,27.96 54.48,30.57 X8.3
M8P20
  Bottom 0.406: MCU.20 52.85,27.16 53.72,28.03 54.6,28.03 | 54.6,28.03 X8.4 | 54.6,28.03 C6.1
M8P22
  Bottom 0.406: MCU.22 51.87,25.56 54.48,22.95 X8.6 61.08,22.95 R41.2 C2.2 | C2.2 62.69,22.99 62.73,22.95 | 62.61,21.3 R42.1 C2.2
M8P23
  Bottom 0.406: MCU.23 51.02,24.76 55.24,20.54 57.78,20.54 X8.7
M8P24
  Bottom 0.406: MCU.24 50.04,23.96 56.13,17.87 X8.8
M8P25
  Bottom 0.406: MCU.25 47.88,21.8 53.97,15.71 X9.1
M8P26
  Bottom 0.406: MCU.26 47.08,20.82 51.43,16.47 X9.2
M8P27
  Bottom 0.406: MCU.27 46.28,19.97 48.89,17.36 X9.3
M8P28
  Bottom 0.406: MCU.28 45.48,18.99 46.35,18.12 X9.4
M8P29  (via drill 0.6)
  Top 0.406: v58.29,40.09 43.81,25.87 X9.5
  Bottom 0.406: MCU.29 44.68,18.99 43.81,18.12 X9.5 43.81,12.92 42.54,11.65 34.92,11.65 33.36,13.21 R23.1 | v58.29,40.09 58.29,40.98 56.97,42.3 X1.3
M8P30  (via drill 0.6)
  Top 0.305: 50.16,34.12 v50.16,41.62
  Top 0.406: X9.6 41.27,14.95 42.67,16.35 42.67,26.63 50.16,34.12
  Bottom 0.406: MCU.30 43.88,19.97 41.27,17.36 X9.6 | X1.8 50.67,43.27 50.67,42.13 v50.16,41.62
M8P31  (via drill 0.6)
  Top 0.305: 47.62,33.49 v47.62,41.62
  Top 0.406: 47.62,33.49 41.52,27.39 41.52,17.74 38.73,14.95 X9.7
  Bottom 0.406: MCU.31 43.08,20.95 38.73,16.6 X9.7 | v47.62,41.62 48.64,41.62 49.27,42.25 49.27,43.14 49.4,43.27 X1.9
M8P32
  Bottom 0.406: MCU.32 42.28,21.8 36.19,15.71 X9.8
MOT_A  (via drill 0.8 pad 1.52)
  Top 0.406: v98.67,37.05 94.36,37.05 93.43,37.97 R2.2 93.47,38.32 93.43,38.36 R3.2 93.47,40.35 93.43,40.39 R1.2
  Top 0.61: PFET_A.5 104.26,42.38
  Top 1.016: NFET_A.5 105.91,38.57 v105.91,39.2 | 105.91,39.84 MOT_A1.P$1 | v105.91,39.2 105.91,39.84 | 105.91,39.84 NFET_A.6 | v104.26,37.05 105.91,38.7 v105.91,39.2 | v105.91,39.2 MOT_A1.P$1 | PFET_A.5 105.91,42.38 v105.91,41.75 105.91,41.11 | MOT_A1.P$1 105.91,41.11 | 105.91,41.11 PFET_A.6
  Route2 1.016: v98.67,37.05 v104.26,37.05
  Bottom 1.016: NFET_A.6 105.91,39.84 MOT_A1.P$1 | PFET_A.5 105.91,42.38 v105.91,41.75 105.91,41.11 | MOT_A1.P$1 105.91,41.11 | NFET_A.5 105.91,38.57 v105.91,39.2 MOT_A1.P$1 | 105.91,41.11 PFET_A.6
MOT_B  (via drill 0.8, 0.8 pad 1.52)
  Top 0.406: R8.2 93.47,26.76 R6.2 93.47,24.6 R7.2 93.43,23.88 94.23,23.08 v98.8,23.08
  Top 1.016: PFET_B.5 106.04,28.41 v106.04,27.78 106.04,27.14 PFET_B.6 | PFET_B.8 106.04,24.6 v106.04,25.24 | v106.04,25.24 106.04,25.87 NFET_B.6 | v106.04,25.24 106.04,24.85 v104.26,23.08 | v106.04,25.24 MOT_B1.P$1
  Route2 1.016: v98.8,23.08 v104.26,23.08
  Bottom 1.016: PFET_B.5 106.04,28.41 v106.04,27.78 106.04,27.14 | 106.04,27.14 MOT_B1.P$1 106.04,25.87 | PFET_B.8 106.04,24.6 v106.04,25.24 106.04,25.87 | 106.04,25.87 NFET_B.6 | 106.04,27.14 PFET_B.6
MOT_C  (via drill 0.8 pad 1.52)
  Top 0.305: R12.2 93.34,33.74
  Top 0.406: v98.67,30.06 94.36,30.06 93.43,30.99 R11.2 93.47,31.59 93.43,31.62 R12.2 93.47,33.74 93.43,33.78 R13.2
  Top 1.016: v104.26,30.06 105.91,31.71 v105.91,32.22 105.91,32.86 | PFET_C.5 105.91,35.39 105.91,34.12 | 105.91,34.12 MOT_C1.P$1 105.91,32.86 | 105.91,34.12 PFET_C.6 | NFET_C.5 105.91,31.59 105.91,32.86 | 105.91,32.86 NFET_C.6
  Route2 1.016: v98.67,30.06 v104.26,30.06
  Bottom 1.016: PFET_C.5 105.91,35.39 v105.91,34.76 105.91,34.12 | 105.91,34.12 MOT_C1.P$1 105.91,32.86 | NFET_C.5 105.91,31.59 v105.91,32.22 105.91,32.86 | 105.91,34.12 PFET_C.6 | 105.91,32.86 NFET_C.6
N$1  (via drill 0.8, 0.8 pad 1.52)
  Top 1.016: U$2.8 106.04,21.43 v106.04,20.92 106.04,20.15 | DC_MOT-1.P$1 106.04,20.15 | U$2.5 106.04,17.61 v106.04,17.87 | v106.04,17.87 106.04,18.89 | 106.04,18.89 DC_MOT-1.P$1 | 106.04,20.15 106.17,20.15 | 106.04,20.15 U$2.7 | 106.04,18.89 106.17,18.89 | 106.04,18.89 U$2.6 | D2.A 106.04,17.09 v106.04,17.87 | v106.04,17.87 DC_MOT-1.P$1
  other vias: 106.04,19.39
N$2
  Top 0.254: 91.73,35.81 R13.1 R2.1
  Top 0.406: U$1.6 80.89,26.12 84.7,29.93 87.88,29.93 88.01,29.93 88.9,30.82 88.9,31.84 90.17,33.11 90.17,34.25 91.69,35.78 91.69,35.9 R13.1 | R2.1 91.69,38.32 90.04,39.97 R15.2
N$3
  Top 0.254: 89.02,41.49 88.01,41.49 88.01,40.73 | 89.02,41.49 89.15,41.49 | R1.1 90.84,41.49 89.02,41.49
  Top 0.406: U$1.11 89.02,33.36 89.02,39.59 88.01,40.6 R4.2 88.01,40.73 87.92,40.64 R22.1
N$5
  Top 0.305: 96.39,38.57 R38.2 NFET_A.4
N$7
  Top 0.406: 96.77,17.61 U$2.4 | 96.77,17.61 R37.1 | R24.1 96.77,16.22 96.77,17.61
N$8
  Top 0.305: 96.52,24.6 R39.2 NFET_B.4
N$9
  Top 0.305: 96.39,31.59 R40.2 NFET_C.4
N$10
  Top 0.254: R6.1 92.58,27.61 92.58,39.5 R3.1
  Top 0.406: U$1.8 87.5,22.95 87.5,20.79 | R6.1 91.69,26.76 91.69,26.72 89.15,24.18 89.15,21.93 88.01,20.79 87.5,20.79 | R5.2 87.5,20.79
N$11  (via drill 0.8 pad 1.52)
  other vias: 98.8,23.08
N$12  (via drill 0.8 pad 1.52)
  Top 0.406: R7.1 90.17,23.04 90.17,20.28 88.51,18.63 R9.2 87.59,18.54 87.62,18.5 v87.62,16.6
  Bottom 0.406: U$1.7 80.64,23.58 v87.62,16.6
N$13  (via drill 0.6)
  Top 0.254: R11.1 91.73,30.32 91.73,28.96 91.69,28.92
  Top 0.406: R10.2 84.2,23.46 85.59,24.85 88.39,24.85 89.78,26.25 89.78,27.14 91.69,29.04 91.73,29.01 R8.1 91.69,28.92 | 91.73,30.32 v91.31,30.32
  Bottom 0.406: U$1.10 88.13,28.66 89.78,30.32 v91.31,30.32
N$15
  Top 0.406: R14.2 82.16,23.33 84.96,26.12 U$1.9 | U$1.9 87.12,26.12 | R12.1 91.69,33.7 91.69,33.36 89.78,31.46 89.78,28.92 86.86,26 U$1.9
N$17  (via drill 0.8)
  other vias: 4.57,32.86
N$18  (via drill 0.8)
  other vias: 7.11,32.86
N$21
  Top 0.406: R21.1 74.93,35.39 74.51,35.81 LED2.A
N$23
  Top 0.406: U$1.5 76.2,28.66 75.81,28.28 R19.2 75.05,27.56 R18.1
N$24
  Bottom 0.406: PFET_B.4 97.53,28.41 96.52,27.39 | 96.52,27.39 T2.3 | R27.1 96.26,25.2 96.26,27.14 96.52,27.39
N$25
  Top 0.406: 75.85,31.33 75.94,31.33 | 75.85,31.33 R20.1 75.98,31.2 U$1.4 | LED1.A 74.83,31.33 75.85,31.33
N$29
  Top 0.406: 72.39,21.43 D1.C R16.2
N$34
  Bottom 0.406: 96.64,41.36 T1.3 | 96.64,41.36 97.66,42.38 PFET_A.4 | R25.1 95.54,38.48 96.64,39.59 96.64,41.36
N$39
  Bottom 0.406: PFET_C.4 97.66,35.39 96.64,34.38 | 96.64,34.38 T3.3 | R29.1 95.54,31.62 96.64,32.73 96.64,34.38
N$46
  Bottom 0.406: R30.2 91.56,33.36 91.63,33.43 T3.1
N$47
  Bottom 0.406: T2.1 93.64,26.42 93.59,26.38 R28.2
N$48
  Bottom 0.406: T1.1 93.64,40.39 93.59,40.35 R26.2
NFET_A  (via drill 0.6)
  Top 0.305: 94.86,38.57 R38.1 94.9,39.75 v95.37,39.84 94.9,39.84 R31.2
  Bottom 0.406: v95.37,39.84 95.12,39.84 92.2,36.92 89.53,36.92 88.77,36.16 88.77,35.78 88.01,35.01 77.85,35.01 70.48,27.65 70.48,27.01 68.32,24.85 X3.7
NFET_B  (via drill 0.6)
  Top 0.305: 94.86,24.6 R39.1 94.9,25.87 | 94.9,25.87 R33.2 | v95.25,25.87 94.9,25.87
  Bottom 0.406: v95.25,25.87 94.23,24.85 77.85,24.85 74.67,21.68 74.67,17.23 72.13,14.69 X3.11
NFET_C  (via drill 0.6)
  Top 0.305: R40.1 94.86,31.59 94.86,32.86 | 94.9,32.86 v95.25,32.86 94.86,32.86 | R35.2 94.86,34.12 94.86,32.86
  Bottom 0.406: X3.9 69.59,19.77 71.12,21.3 71.12,23.2 77.85,29.93 88.13,29.93 90.17,31.97 94.36,31.97 v95.25,32.86
PFET_A
  Bottom 0.406: R26.1 89.78,38.32 89.82,38.36 89.82,39.33 | 89.82,39.33 R32.2 | 89.82,39.33 89.82,39.24 88.13,37.55 77.72,37.55 70.35,30.19 70.35,29.43 68.32,27.39 X3.6
PFET_B
  Bottom 0.406: R28.1 89.78,26.38 89.82,26.42 89.82,27.39 | 89.82,27.39 R34.2 | 89.82,27.39 77.72,27.39 72.89,22.57 72.89,19.14 70.99,17.23 X3.10
PFET_C
  Bottom 0.406: R30.1 89.82,33.45 89.78,33.49 89.82,33.53 89.82,34.38 | 89.82,34.38 R36.2 | 89.82,34.38 89.82,33.78 88.51,32.47 77.85,32.47 70.99,25.62 70.99,24.85 68.45,22.31 X3.8
PWM_DC  (via drill 0.8 pad 1.52)
  Top 0.406: R24.2 94.99,16.22 94.19,17.02 D3.3 93.21,16.22 90.17,13.17 v88.39,13.17 | X3.12 65.4,12.15 63.62,13.93 JP1.2
  Bottom 0.406: v88.39,13.17 69.84,13.17 68.83,12.15 X3.12

### Text on the board
Top: Paparazzi - blmc
Bottom: BLMC_M8_DEV | 03/06-poine